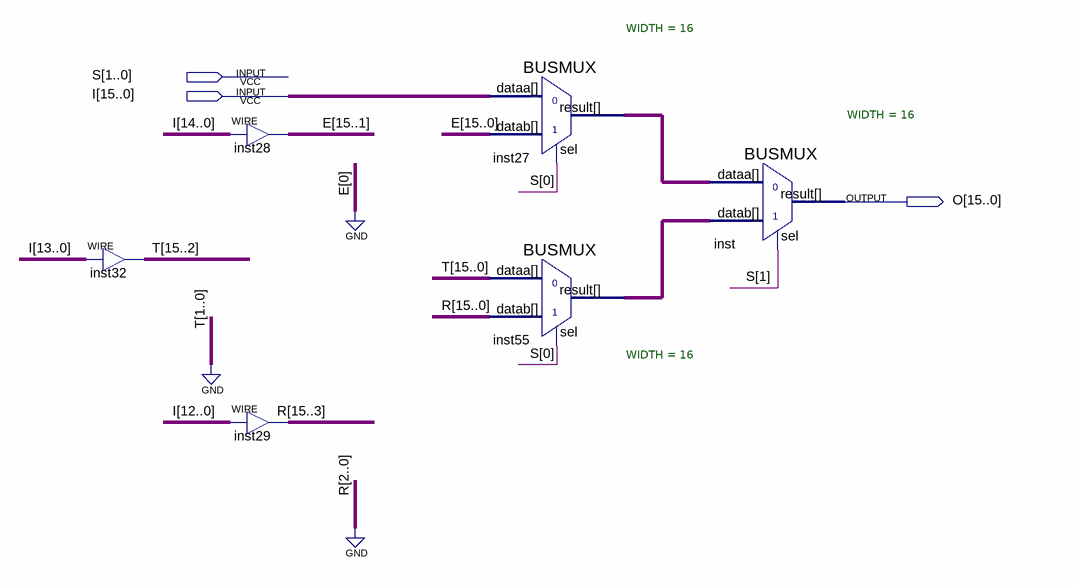
[diagram p0: schematic sheet]
// Quartus schematic ShiftLeft.bdf as structural Verilog: 6 symbols, 3 pins
module ShiftLeft (
  input  [1:0] S,
  input  [15:0] I,
  output [15:0] O
);

  wire [15:0] inst27_result, inst55_result;
  wire [15:1] E;
  wire [15:2] T;
  wire [15:3] R;

  assign T = I[13:0];  // WIRE inst32
  assign E = I[14:0];  // WIRE inst28
  assign R = I[12:0];  // WIRE inst29
  BUSMUX #(.WIDTH(16)) inst27 (.datab({E, 1'b0}), .sel(S[0]), .dataa(I), .result(inst27_result));
  BUSMUX #(.WIDTH(16)) inst55 (.datab({R, 3'b000}), .sel(S[0]), .dataa({T, 2'b00}), .result(inst55_result));
  BUSMUX #(.WIDTH(16)) inst (.datab(inst55_result), .sel(S[1]), .dataa(inst27_result), .result(O));
endmodule
